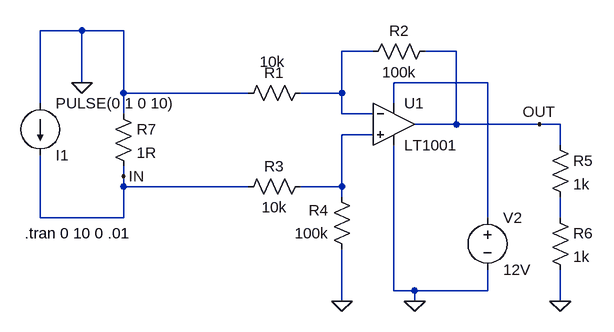
[diagram p0: schematic current.asc]
current.asc, the LTspice schematic file:
Version 4
SHEET 1 964 680
WIRE -96 16 -160 16
WIRE -32 16 -96 16
WIRE 352 48 304 48
WIRE 480 48 432 48
WIRE -96 96 -96 16
WIRE 528 96 384 96
WIRE -32 112 -32 16
WIRE 160 112 -32 112
WIRE 304 112 304 48
WIRE 304 112 240 112
WIRE -160 128 -160 16
WIRE 384 128 384 96
WIRE -32 144 -32 112
WIRE 304 144 304 112
WIRE 352 144 304 144
WIRE 480 160 480 48
WIRE 480 160 416 160
WIRE 608 160 480 160
WIRE 640 160 608 160
WIRE 352 176 304 176
WIRE 640 192 640 160
WIRE -32 240 -32 224
WIRE -32 256 -32 240
WIRE 160 256 -32 256
WIRE 304 256 304 176
WIRE 304 256 240 256
WIRE 304 272 304 256
WIRE -160 304 -160 208
WIRE -32 304 -32 256
WIRE -32 304 -160 304
WIRE 528 304 528 96
WIRE 640 304 640 272
WIRE 384 416 384 192
WIRE 416 416 384 416
WIRE 528 416 528 384
WIRE 528 416 416 416
WIRE 304 432 304 352
WIRE 416 432 416 416
WIRE 640 432 640 384
FLAG -96 96 0
FLAG 416 432 0
FLAG 608 160 OUT
FLAG 304 432 0
FLAG 640 432 0
FLAG -32 240 IN
SYMBOL voltage 528 288 R0
WINDOW 123 0 0 Left 2
WINDOW 39 0 0 Left 2
SYMATTR InstName V2
SYMATTR Value 12V
SYMBOL Opamps\\LT1001 384 96 R0
SYMATTR InstName U1
SYMBOL res 256 96 R90
WINDOW 0 0 56 VBottom 2
WINDOW 3 -48 59 VTop 2
SYMATTR InstName R1
SYMATTR Value 10k
SYMBOL res 448 32 R90
WINDOW 0 0 56 VBottom 2
WINDOW 3 32 56 VTop 2
SYMATTR InstName R2
SYMATTR Value 100k
SYMBOL res 256 240 R90
WINDOW 0 0 56 VBottom 2
WINDOW 3 32 56 VTop 2
SYMATTR InstName R3
SYMATTR Value 10k
SYMBOL res 320 368 R180
WINDOW 0 36 76 Left 2
WINDOW 3 36 40 Left 2
SYMATTR InstName R4
SYMATTR Value 100k
SYMBOL res 624 176 R0
SYMATTR InstName R5
SYMATTR Value 1k
SYMBOL res 624 288 R0
SYMATTR InstName R6
SYMATTR Value 1k
SYMBOL res -48 128 R0
SYMATTR InstName R7
SYMATTR Value 1R
SYMBOL current -160 128 R0
WINDOW 0 24 80 Left 2
WINDOW 3 24 0 Left 2
WINDOW 123 0 0 Left 2
WINDOW 39 0 0 Left 2
SYMATTR InstName I1
SYMATTR Value PULSE(0 1 0 10)
TEXT -184 328 Left 2 !.tran 0 10 0 .01

The netlist it stands for:
* current.asc
V2 N002 0 12V
XU1 N003 N001 N002 0 OUT LT1001  ; pins In+ In- V+ V- OUT
R1 N001 0 10k
R2 OUT N001 100k
R3 N003 IN 10k
R4 0 N003 100k
R5 OUT N004 1k
R6 N004 0 1k
R7 0 IN 1R
I1 0 IN PULSE(0 1 0 10)
.tran 0 10 0 .01
.lib LTC.lib
.backanno
.end